# EAGLE board fc-comms-2 (EAGLE 9.0.1), part 1 of 2
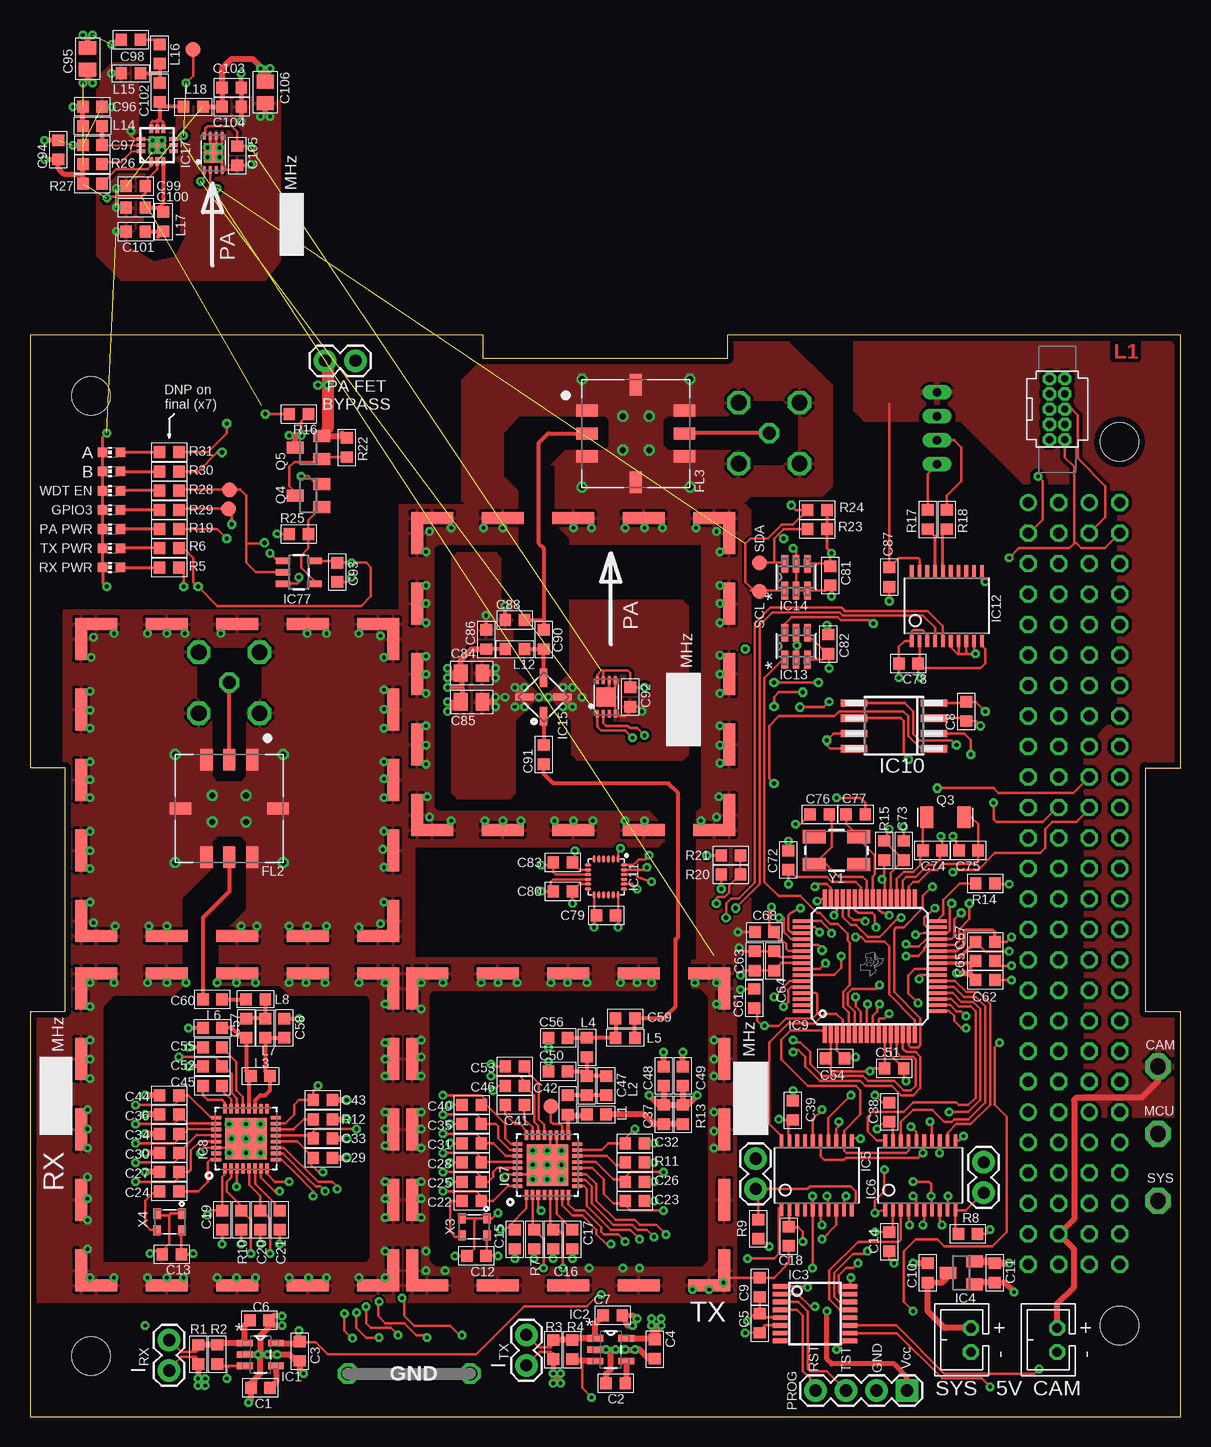
[diagram p2: board, top side]
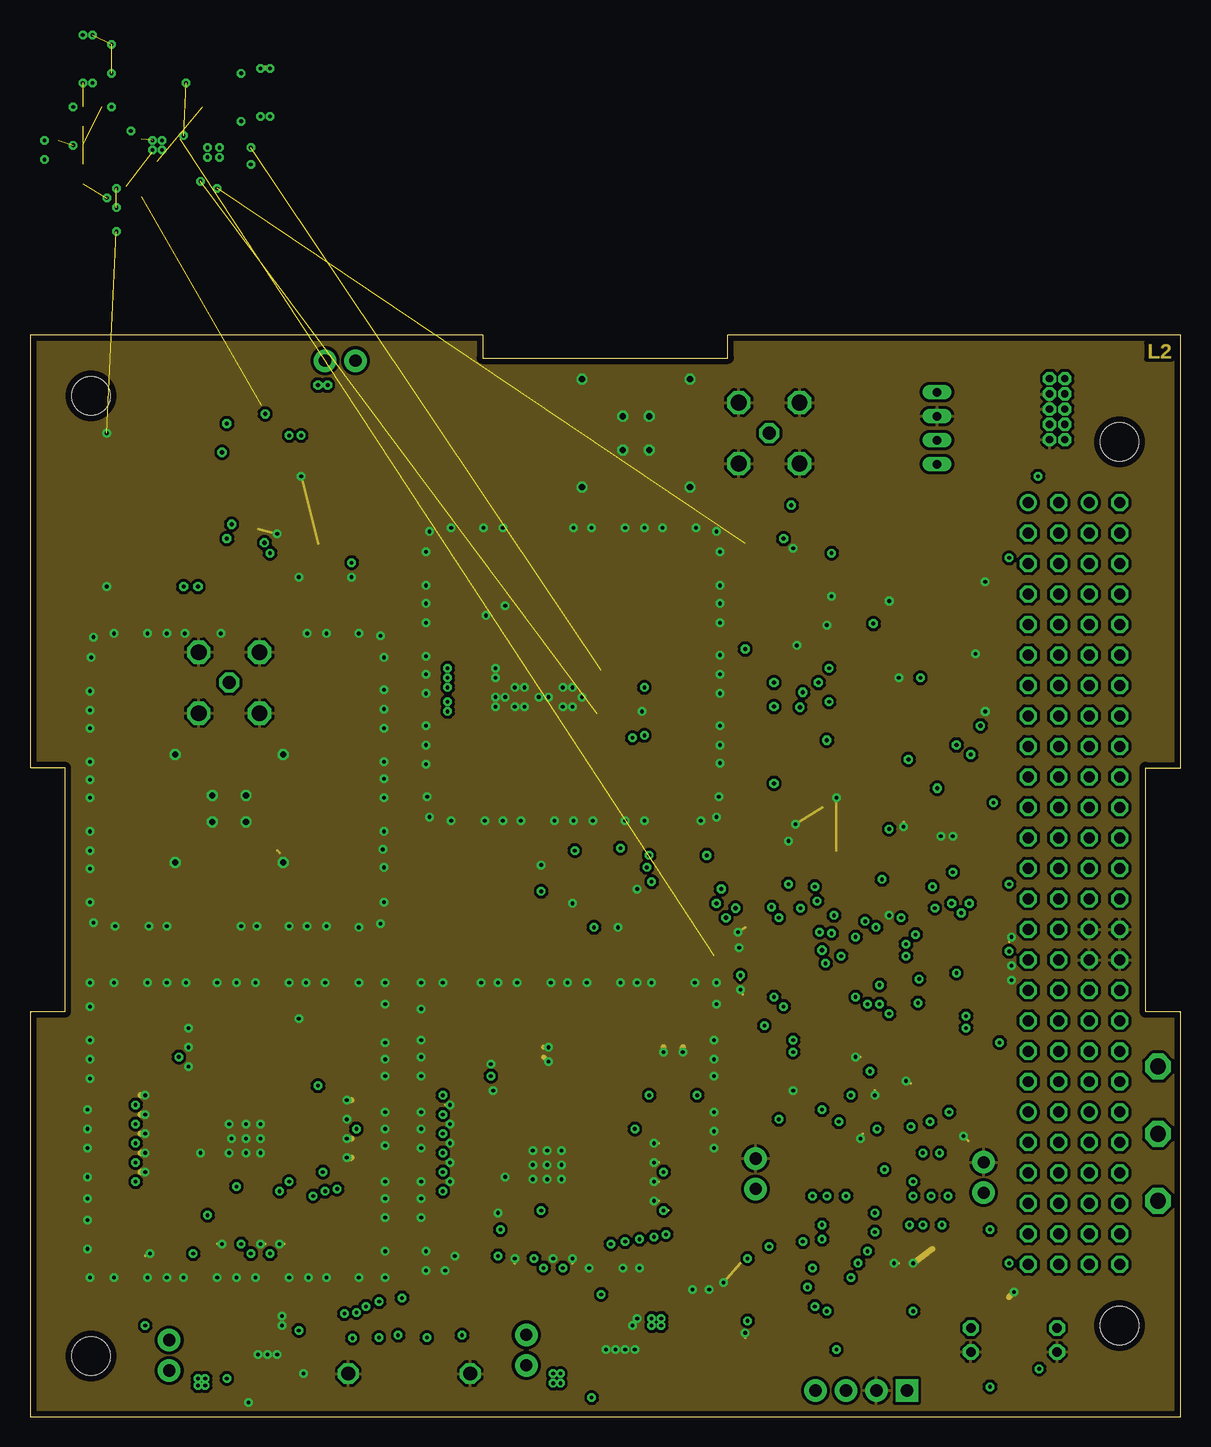
[diagram p3: board, inner layer Route2]
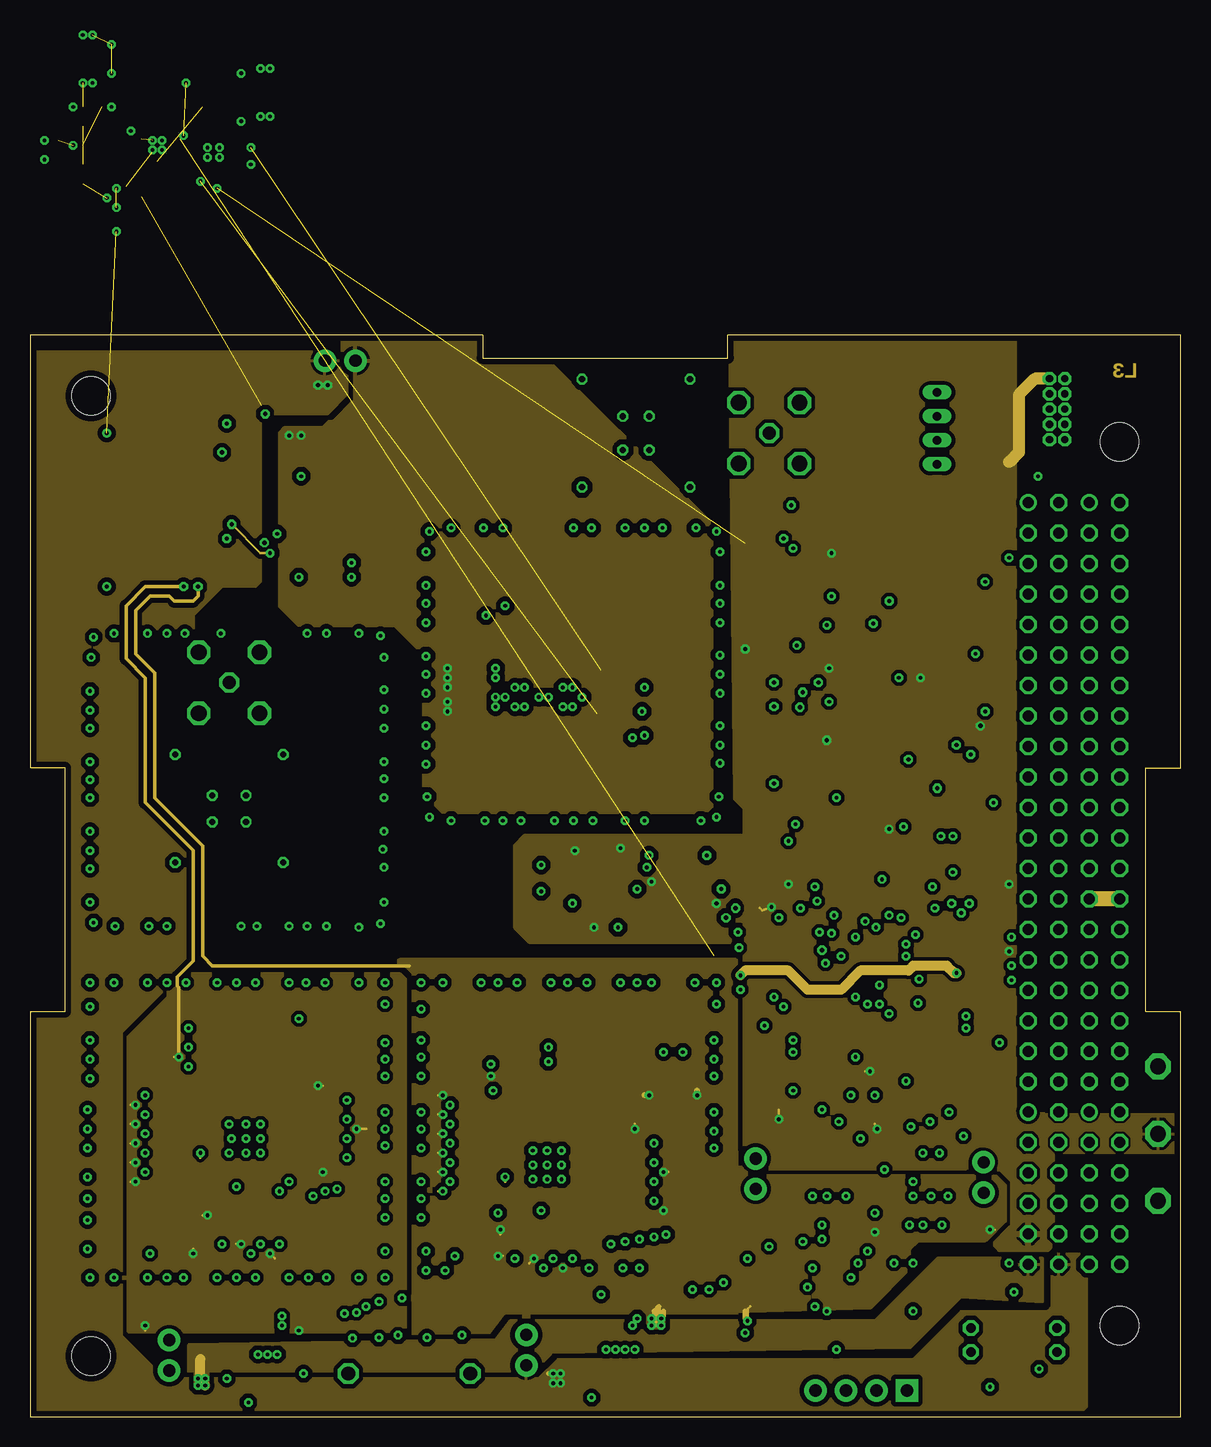
[diagram p4: board, inner layer Route15]
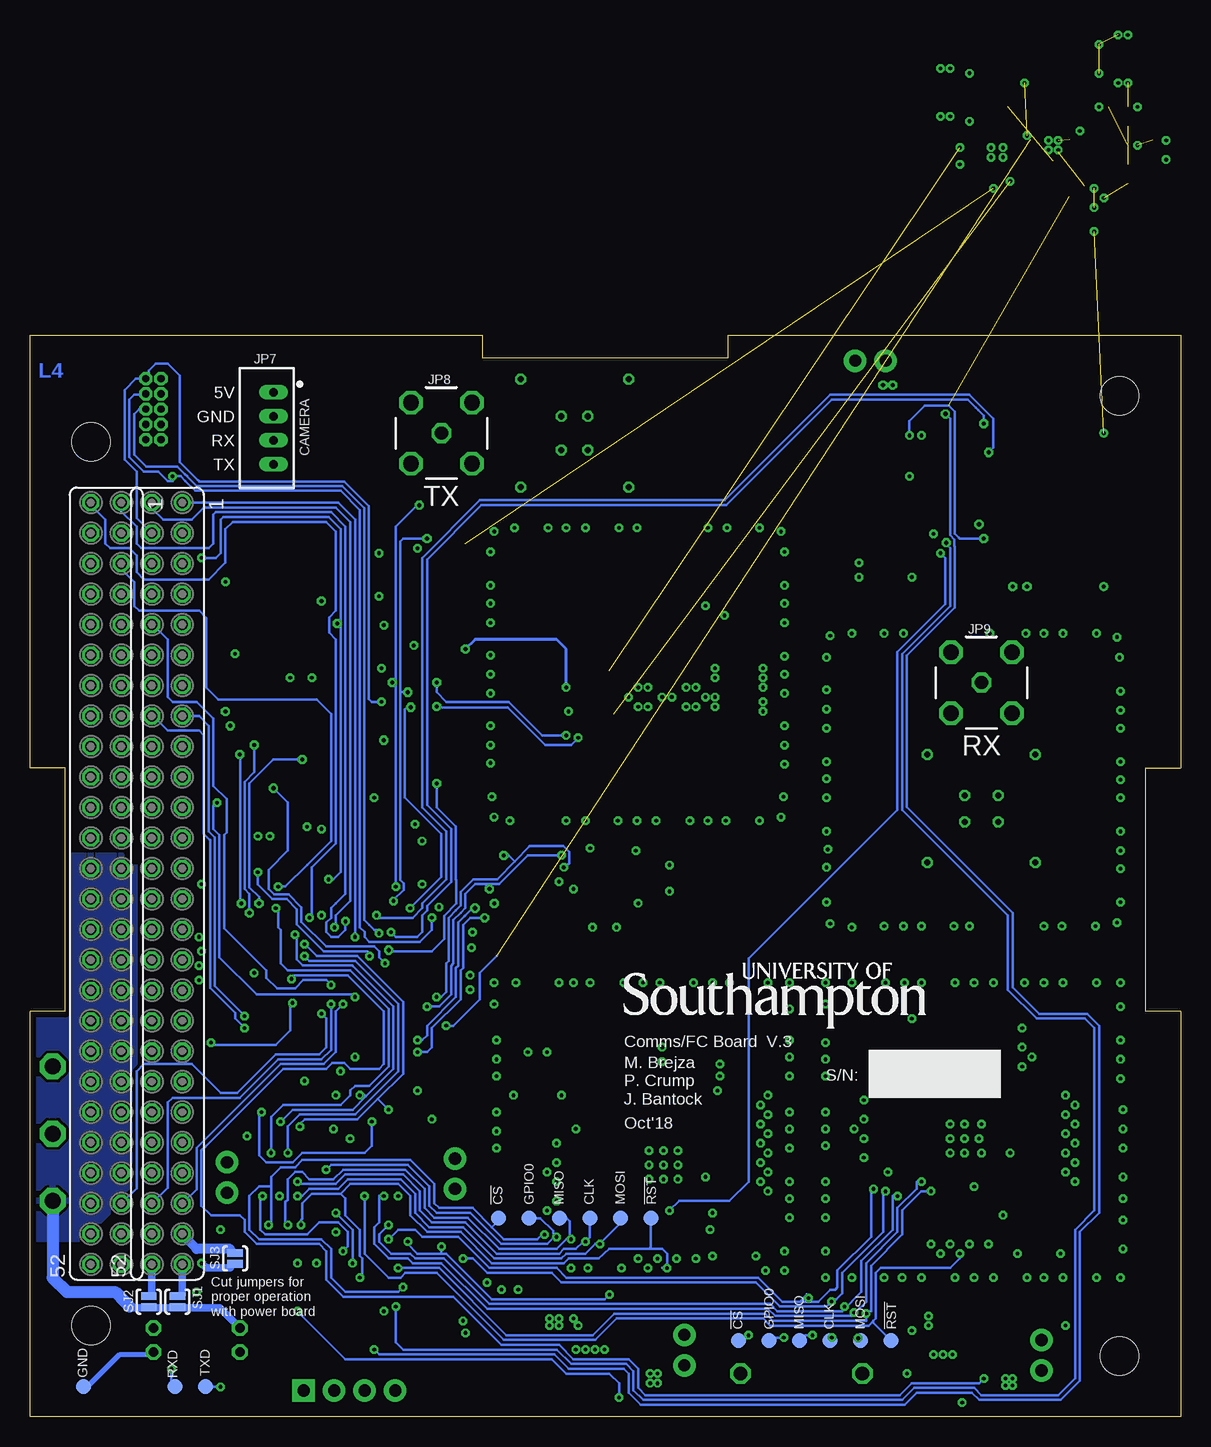
[diagram p5: board, bottom side, seen from below]

Size 95.89 x 90.17 mm. Coordinates in mm from the lower left corner, seen from the top.
Copper layers (1*2*15*16): Top 0.035mm / dielectric 0.15mm / Route2 0.035mm / dielectric 1.2mm / Route15 0.035mm / dielectric 0.15mm / Bottom 0.035mm
Design rules "default *": minimum track width 0.2mm, minimum drill 12mil, track to track 7mil, track to pad 7mil, pad to pad 7mil, via to via 8mil, smd to smd 5mil, copper to edge 20mil, drill to drill 8mil, minimum pad ring 10mil, minimum via ring 8mil, stop-mask expansion 4mil, vias tented up to drill 15mil, thermal gap 10mil

## Footprints (pad centres in the part's own frame; a part is rotated, then mirrored left to right if it is on the bottom)
C0603-N = smd 0.95 x 1: 1 -0.8,0; 2 0.8,0
C0805-N = smd 1.15 x 1.45: 1 -0.9,0; 2 0.9,0
PL-176 = smd 1.016 x 1.778: 1 -1.905,-4.064; 2 0,-4.064; 3 1.905,-4.064; 5 1.905,4.064; 6 0,4.064; 7 -1.905,4.064 | smd 1.778 x 1.016: 4 4.064,0; 8 -4.064,0
GND-LOOP-0.4 = drill 1.15 octagon: P$3 -5.08,0; P$4 5.08,0
SOT95P280X110-5N = smd 1.321 x 0.559: 1 -1.295,0.94; 2 -1.295,0; 3 -1.295,-0.94; 4 1.295,-0.94; 5 1.295,0.94
SSOP16 = smd 0.4 x 1.2: 1 -2.275,-2.925; 2 -1.625,-2.925; 3 -0.975,-2.925; 4 -0.325,-2.925; 5 0.325,-2.925; 6 0.975,-2.925; 7 1.625,-2.925; 8 2.275,-2.925; 9 2.275,2.925; 10 1.625,2.925; 11 0.975,2.925; 12 0.325,2.925; 13 -0.325,2.925; 14 -0.975,2.925; 15 -1.625,2.925; 16 -2.275,2.925
SOT23 = smd 1 x 1.4: 1 -0.95,-1.1; 2 0.95,-1.1; 3 0,1.1
TSSOP20 = smd 0.305 x 0.991: 1 -2.925,-2.918; 2 -2.275,-2.918; 3 -1.625,-2.918; 4 -0.975,-2.918; 5 -0.325,-2.918; 6 0.325,-2.918; 7 0.975,-2.918; 8 1.625,-2.918; 9 2.275,-2.918; 10 2.925,-2.918; 11 2.925,2.918; 12 2.275,2.918; 13 1.625,2.918; 14 0.975,2.918; 15 0.325,2.918; 16 -0.325,2.918; 17 -0.975,2.918; 18 -1.625,2.918; 19 -2.275,2.918; 20 -2.925,2.918
QFN32_5X5 = smd 0.813 x 0.305: 1 -2.489,1.753; 2 -2.489,1.245; 3 -2.489,0.762; 4 -2.489,0.254; 5 -2.489,-0.254; 6 -2.489,-0.762; 7 -2.489,-1.245; 8 -2.489,-1.753; 17 2.489,-1.753; 18 2.489,-1.245; 19 2.489,-0.762; 20 2.489,-0.254; 21 2.489,0.254; 22 2.489,0.762; 23 2.489,1.245; 24 2.489,1.753 | smd 0.305 x 0.813: 9 -1.753,-2.489; 10 -1.245,-2.489; 11 -0.762,-2.489; 12 -0.254,-2.489; 13 0.254,-2.489; 14 0.762,-2.489; 15 1.245,-2.489; 16 1.753,-2.489; 25 1.753,2.489; 26 1.245,2.489; 27 0.762,2.489; 28 0.254,2.489; 29 -0.254,2.489; 30 -0.762,2.489; 31 -1.245,2.489; 32 -1.753,2.489 | smd 3.45 x 3.45: 33 0,0
PM_S-PQFP-G64 = smd 1.6 x 0.3: 1 -5.6,3.75; 2 -5.6,3.25; 3 -5.6,2.75; 4 -5.6,2.25; 5 -5.6,1.75; 6 -5.6,1.25; 7 -5.6,0.75; 8 -5.6,0.25; 9 -5.6,-0.25; 10 -5.6,-0.75; 11 -5.6,-1.25; 12 -5.6,-1.75; 13 -5.6,-2.25; 14 -5.6,-2.75; 15 -5.6,-3.25; 16 -5.6,-3.75; 33 5.6,-3.75; 34 5.6,-3.25; 35 5.6,-2.75; 36 5.6,-2.25; 37 5.6,-1.75; 38 5.6,-1.25; 39 5.6,-0.75; 40 5.6,-0.25; 41 5.6,0.25; 42 5.6,0.75; 43 5.6,1.25; 44 5.6,1.75; 45 5.6,2.25; 46 5.6,2.75; 47 5.6,3.25; 48 5.6,3.75 | smd 0.3 x 1.6: 17 -3.75,-5.6; 18 -3.25,-5.6; 19 -2.75,-5.6; 20 -2.25,-5.6; 21 -1.75,-5.6; 22 -1.25,-5.6; 23 -0.75,-5.6; 24 -0.25,-5.6; 25 0.25,-5.6; 26 0.75,-5.6; 27 1.25,-5.6; 28 1.75,-5.6; 29 2.25,-5.6; 30 2.75,-5.6; 31 3.25,-5.6; 32 3.75,-5.6; 49 3.75,5.6; 50 3.25,5.6; 51 2.75,5.6; 52 2.25,5.6; 53 1.75,5.6; 54 1.25,5.6; 55 0.75,5.6; 56 0.25,5.6; 57 -0.25,5.6; 58 -0.75,5.6; 59 -1.25,5.6; 60 -1.75,5.6; 61 -2.25,5.6; 62 -2.75,5.6; 63 -3.25,5.6; 64 -3.75,5.6
SO-08M = smd 0.6 x 2.2: 1 -1.905,-3.33; 2 -0.635,-3.33; 3 0.635,-3.33; 4 1.905,-3.33; 5 1.905,3.33; 6 0.635,3.33; 7 -0.635,3.33; 8 -1.905,3.33
QFN-24/3MM = smd 0.6 x 0.23: 1 -1.5,1; 2 -1.5,0.6; 3 -1.5,0.2; 4 -1.5,-0.2; 5 -1.5,-0.6; 6 -1.5,-1; 13 1.5,-1; 14 1.5,-0.6; 15 1.5,-0.2; 16 1.5,0.2; 17 1.5,0.6; 18 1.5,1 | smd 0.23 x 0.6: 7 -1,-1.5; 8 -0.6,-1.5; 9 -0.2,-1.5; 10 0.2,-1.5; 11 0.6,-1.5; 12 1,-1.5; 19 1,1.5; 20 0.6,1.5; 21 0.2,1.5; 22 -0.2,1.5; 23 -0.6,1.5; 24 -1,1.5
DBV6 = smd 1.473 x 0.559: 1 -1.118,0.95; 2 -1.118,0; 3 -1.118,-0.95; 4 1.118,-0.95; 5 1.118,0; 6 1.118,0.95
PA = smd 1.55 x 0.61: GND1 -1.59,0; GND2 1.59,0 | smd 0.61 x 1.55: RF_IN 0,-1.59; RF_OUT 0,1.59
HWSON8 = smd 0.25 x 0.625: 1 -0.75,-1.41; 2 -0.25,-1.41; 3 0.25,-1.41; 4 0.75,-1.41; 5 0.75,1.41; 6 0.25,1.41; 7 -0.25,1.41; 8 -0.75,1.41 | smd 1.6 x 1.6: EP 0,0
QFN3X3-6 = smd 0.7 x 0.3: 1 -1.35,0.5; 2 -1.35,0; 3 -1.35,-0.5; 7 1.35,-0.5; 8 1.35,0; 9 1.35,0.5 | smd 0.3 x 0.7: 4 -0.5,-1.35; 5 0,-1.35; 6 0.5,-1.35; 10 0.5,1.35; 11 0,1.35; 12 -0.5,1.35 | smd 1.45 x 1.45: EXP 0,0
SOT23-5 = smd 0.55 x 1.2: 1 -0.95,-1.3; 2 0,-1.3; 3 0.95,-1.3; 4 0.95,1.3; 5 -0.95,1.3
JST-2-TH = drill 0.8 octagon: 1 1,0; 2 -1,0
SWD_PTH_SHROUD = drill 0.6 octagon: 1 -2.54,-0.635; 2 -2.54,0.635; 3 -1.27,-0.635; 4 -1.27,0.635; 5 0,-0.635; 6 0,0.635; 7 1.27,-0.635; 8 1.27,0.635; 9 2.54,-0.635; 10 2.54,0.635
1X04 = drill 1.016 pad 1.88 square: 1 0,0 | drill 1.016 pad 1.88: 2 2.54,0; 3 5.08,0; 4 7.62,0
1X02 = drill 1.016 pad 1.88: 1 0,0; 2 2.54,0
B4B-PH-K-S = drill 0.7 long: 1 -3,0; 2 -1,0; 3 1,0; 4 3,0
MCX-STRAIGHT = drill 1.1 octagon: P$1 0,0 | drill 1.3 octagon: P$2 2.54,2.54; P$3 -2.54,2.54; P$4 -2.54,-2.54; P$5 2.54,-2.54
L0603-N = smd 0.95 x 1: 1 -0.8,0; 2 0.8,0
CHIP-LED0603 = smd 0.8 x 0.8: A 0,-0.75; C 0,0.75
RESONATOR_EPSON_FC_145 = smd 1.1 x 1.8: P$1 -1.55,0; P$2 1.55,0
R0603-N = smd 0.95 x 1: 1 -0.8,0; 2 0.8,0
PAD-JUMPER-2-NO_YES_SILK = smd 0.635 x 1.27: 1 -0.45,0; 2 0.45,0
FE26-2 = drill 0.914: 1 -30.48,1.27; 41 20.32,1.27 | drill 0.914 octagon: 2 -30.48,-1.27; 3 -27.94,1.27; 4 -27.94,-1.27; 5 -25.4,1.27; 6 -25.4,-1.27; 7 -22.86,1.27; 8 -22.86,-1.27; 9 -20.32,1.27; 10 -20.32,-1.27; 11 -17.78,1.27; 12 -17.78,-1.27; 13 -15.24,1.27; 14 -15.24,-1.27; 15 -12.7,1.27; 16 -12.7,-1.27; 17 -10.16,1.27; 18 -10.16,-1.27; 19 -7.62,1.27; 20 -7.62,-1.27; 21 -5.08,1.27; 22 -5.08,-1.27; 23 -2.54,1.27; 24 -2.54,-1.27; 25 0,1.27; 26 0,-1.27; 27 2.54,1.27; 28 2.54,-1.27; 29 5.08,1.27; 30 5.08,-1.27; 31 7.62,1.27; 32 7.62,-1.27; 33 10.16,1.27; 34 10.16,-1.27; 35 12.7,1.27; 36 12.7,-1.27; 37 15.24,1.27; 38 15.24,-1.27; 39 17.78,1.27; 40 17.78,-1.27; 42 20.32,-1.27; 43 22.86,1.27; 44 22.86,-1.27; 45 25.4,1.27; 46 25.4,-1.27; 47 27.94,1.27; 48 27.94,-1.27; 49 30.48,1.27; 50 30.48,-1.27; 51 33.02,1.27; 52 33.02,-1.27
P1-13 = drill 1.321 pad 2.159 octagon: TP 0,0
B1,27 = smd 1.27 x 1.27: TP 0,0
OUTLINE = hole 3.2: 5.08,5.08; 5.08,85.09; 90.805,7.62; 90.805,81.28
SHIELD-26X26 = smd 3.5 x 1: G1 1.75,0.5; G7 25.25,26.5; G8 1.75,26.5; G9 13.5,26.5; G10 7.625,26.5; G11 19.375,26.5; G17 25.25,0.5; G19 13.5,0.5; G20 7.625,0.5; G21 19.375,0.5 | smd 1 x 3.5: G2 0.5,1.75; G3 0.5,25.25; G4 0.5,13.5; G5 0.5,19.375; G6 0.5,7.625; G12 26.5,1.75; G13 26.5,25.25; G14 26.5,13.5; G15 26.5,19.375; G16 26.5,7.625
260-SERIES = smd 0.63 x 0.84: 1 -1.04,-0.7; 3 1.04,-0.7; 4 1.04,0.7; 6 -1.04,0.7
CRYSTAL-SMD-5X3.2-4PAD = smd 1.9 x 1.1: 1 -1.85,-1.15; 2 1.85,-1.15; 3 1.85,1.15; 4 -1.85,1.15

## Placement (x,y rotation side)
C1  10n  [C0603-N]  19.2,2.4 180 top
C2  10n  [C0603-N]  48.8,2.8 180 top
C3  2u2  [C0603-N]  22.46,5.47 270 top
C4  2u2  [C0603-N]  52.06,5.64 270 top
C5  1u  [C0603-N]  60.8,7.8 270 top
C6  2u2  [C0603-N]  19.12,8.06 0 top
C7  2u2  [C0603-N]  48.55,8.46 0 top
C8  0.1u  [C0603-N]  78,58.8 90 top
C9  100n  [C0603-N]  60.8,10.8 90 top
C10  4.7u  [C0603-N]  74.8,12 90 top
C11  4.7u  [C0603-N]  80.4,12 270 top
C12  100n  [C0603-N]  37.2,13.4 180 top
C13  100n  [C0603-N]  11.82,13.56 180 top
C14  100n  [C0603-N]  71.6,14.6 270 top
C15  47n  [C0603-N]  40.4,14.8 90 top
C16  47n  [C0603-N]  43.6,14.8 90 top
C17  220n  [C0603-N]  45.2,14.8 270 top
C18  100n  [C0603-N]  63.24,15.06 270 top
C19  47n  [C0603-N]  16,16.4 90 top
C20  47n  [C0603-N]  19.2,16.4 90 top
C21  220n  [C0603-N]  20.8,16.4 270 top
C22  10n  [C0603-N]  36.8,18 0 top
C23  47n  [C0603-N]  50.4,18 180 top
C24  10n  [C0603-N]  11.6,18.8 0 top
C25  47n  [C0603-N]  36.8,19.6 0 top
C26  47n  [C0603-N]  50.4,19.6 180 top
C27  47n  [C0603-N]  11.6,20.4 0 top
C28  47n  [C0603-N]  36.8,21.2 0 top
C29  47n  [C0603-N]  24.4,21.6 180 top
C30  47n  [C0603-N]  11.6,22 0 top
C31  47n  [C0603-N]  36.8,22.8 0 top
C32  47n  [C0603-N]  50.4,22.8 180 top
C33  47n  [C0603-N]  24.4,23.2 180 top
C34  47n  [C0603-N]  11.6,23.6 0 top
C35  47n  [C0603-N]  36.8,24.4 0 top
C36  47n  [C0603-N]  11.6,25.2 0 top
C37  100p  [C0603-N]  52.8,25.2 270 top
C38  100n  [C0603-N]  71.6,25.4 90 top
C39  100n  [C0603-N]  63.56,25.55 90 top
C40  47n  [C0603-N]  36.8,26 0 top
C41  1.8n  [C0603-N]  40.4,26 180 top
C42  82p  [C0603-N]  44.8,26 90 top
C43  47n  [C0603-N]  24.4,26.4 180 top
C44  47n  [C0603-N]  11.6,26.8 0 top
C45  1.8n  [C0603-N]  15.2,27.6 180 top
C46  47n  [C0603-N]  40.4,27.6 0 top
C47  12p  [C0603-N]  46.4,27.6 90 top
C48  100p  [C0603-N]  52.8,28.4 90 top
C49  10n  [C0603-N]  54.4,28.4 90 top
C50  12p  [C0603-N]  44,28.8 0 top
C51  0.01u  [C0603-N]  72.01,29.06 0 top
C52  47n  [C0603-N]  15.2,29.2 0 top
C53  10n  [C0603-N]  40.4,29.2 180 top
C54  1.0u  [C0603-N]  67.09,29.88 0 top
C55  10n  [C0603-N]  15.2,30.8 180 top
C56  15p  [C0603-N]  44,31.6 0 top
C57  5.1p  [C0603-N]  18,32.4 90 top
C58  5.1p  [C0603-N]  21.2,32.4 90 top
C59  1.2p  [C0603-N]  49.6,33.2 0 top
C60  [C0603-N]  15.2,34.8 180 top
C61  100p  [C0603-N]  60.34,34.87 90 top
C62  2.2u  [C0603-N]  79.6,36.4 0 top
C63  0.1u  [C0603-N]  60.4,38 90 top
C64  0.1u  [C0603-N]  62,38 90 top
C65  1.0u  [C0603-N]  79.6,38 0 top
C67  0.01u  [C0603-N]  79.6,39.6 0 top
C68  0.01u  [C0603-N]  61.2,40.4 180 top
C72  0.1u  [C0603-N]  63.2,46.4 90 top
C73  0.1u  [C0603-N]  72.8,47.2 90 top
C74  24p  [C0603-N]  75.2,47.2 0 top
C75  24p  [C0603-N]  78.2,47.2 180 top
C76  10p  [C0603-N]  65.8,50.2 180 top
C77  10p  [C0603-N]  68.8,50.2 0 top
C78  0.1u  [C0603-N]  73.2,62.8 180 top
C79  0.1u  [C0603-N]  48,41.8 0 top
C80  0.1u  [C0603-N]  44.4,43.8 0 top
C81  0.1u  [C0603-N]  66.68,70.11 270 top
C82  0.1u  [C0603-N]  66.52,64.41 90 top
C83  0.01u  [C0603-N]  44.4,46.2 180 top
C84  [C0805-N]  36.8,62 0 top
C85  [C0805-N]  36.8,59.6 0 top
C86  ??  [C0603-N]  38,64.8 270 top
C87  0.1u  [C0603-N]  71.6,70 270 top
C88  dnp  [C0603-N]  40.4,66.4 0 top
C90  ??  [C0603-N]  42.8,64.8 90 top
C91  1n  [C0603-N]  42.8,55.2 90 top
C92  100n  [C0603-N]  50,60 270 top
C93  100n  [C0603-N]  25.6,70.4 270 top
C94  1u  [C0603-N]  2.34,105.61 90 top  (outside the outline)
C95  [C0805-N]  4.8,113.2 90 top  (outside the outline)
C96  1u  [C0603-N]  5.2,109.2 0 top  (outside the outline)
C97  3.3p  [C0603-N]  5.2,106 180 top  (outside the outline)
C98  33p  [C0603-N]  8.4,114.8 180 top  (outside the outline)
C99  100p  [C0603-N]  8.8,102.6 180 top  (outside the outline)
C100  27p  [C0603-N]  8.8,100.8 180 top  (outside the outline)
C101  15p  [C0603-N]  8.8,98.8 180 top  (outside the outline)
C102  220p  [C0603-N]  10.8,110.4 270 top  (outside the outline)
C103  4.7u  [C0603-N]  16.8,110.8 0 top  (outside the outline)
C104  1n  [C0603-N]  16.8,109.2 0 top  (outside the outline)
C105  100n  [C0603-N]  17.26,105.12 270 top  (outside the outline)
C106  [C0805-N]  19.6,110.4 270 top  (outside the outline)
FL2  SAW_FILTER_CS  [PL-176]  16.61,50.71 180 top
FL3  LPF_CS  [PL-176]  50.49,81.97 270 top
G1  GND-LOOPL  [GND-LOOP-0.4]  31.6,3.6 0 top
IC1  TPS79930QDDCRQ1  [SOT95P280X110-5N]  19.2,5.2 0 top
IC2  TPS79930QDDCRQ1  [SOT95P280X110-5N]  48.4,5.6 0 top
IC3  MSP430FR2311PW  [SSOP16]  65.41,8.6 270 top
IC4  MCP1700TT  [SOT23]  77.6,12 90 top
IC5  TXB0108PW  [TSSOP20]  65.56,20.12 0 top
IC6  TXB0108PW  [TSSOP20]  74.19,20.12 0 top
IC7  CC1125RHBT  [QFN32_5X5]  43.12,20.99 90 top
IC8  CC1125RHBT  [QFN32_5X5]  18,23.2 90 top
IC9  TM4C123[7,G]XXPM  [PM_S-PQFP-G64]  69.98,37.57 90 top
IC10  FM25V10  [SO-08M]  72,57.6 90 top
IC11  MPU-9250  [QFN-24/3MM]  48,45 270 top
IC12  TXB0108PW  [TSSOP20]  76.4,67.6 0 top
IC13  TPS3813K33-EP_DBV_6  [DBV6]  63.84,64.25 90 top
IC14  TMP100-EP_DBV_6  [DBV6]  63.84,70 90 top
IC15  LHA1+  [PA]  42.8,60 0 top
IC16  PCT2075TP  [HWSON8]  48,60 0 top
IC17  MMZ09332BT1  [QFN3X3-6]  10.6,106 90 top  (outside the outline)
IC18  PCT2075TP  [HWSON8]  15.27,105.36 0 top  (outside the outline)
IC77  74LVC1G08  [SOT23-5]  22.4,70.4 270 top
J1  [JST-2-TH]  78.4,6.4 90 top
J2  [JST-2-TH]  85.6,6.4 90 top
J3  SWD_SHROUD  [SWD_PTH_SHROUD]  85.6,84 270 top
JP1  [1X04]  73.08,2.19 180 top
JP2  M02PTH  [1X02]  41.36,4.29 90 top
JP3  M02PTH  [1X02]  11.6,6.4 270 top
JP5  M02PTH  [1X02]  79.47,18.68 90 top
JP6  M02PTH  [1X02]  60.47,18.99 90 top
JP7  B4B-PH-K-S  [B4B-PH-K-S]  75.6,82.4 270 bottom
JP8  MCX  [MCX-STRAIGHT]  61.6,82 0 bottom
JP9  MCX  [MCX-STRAIGHT]  16.6,61.2 0 bottom
JP10  M02PTH  [1X02]  24.58,88.04 0 top
L1  220n  [L0603-N]  47.2,25.2 0 top
L2  18n  [L0603-N]  48,27.6 90 top
L3  56n  [L0603-N]  19.2,28.4 0 top
L4  100n  [L0603-N]  46.4,30.8 90 top
L5  68n  [L0603-N]  49.6,31.6 0 top
L6  27n  [L0603-N]  15.2,32.4 0 top
L7  27u  [L0603-N]  19.6,32.4 90 top
L8  15n  [L0603-N]  18.8,34.8 180 top
L12  220n  [L0603-N]  40.4,64 180 top
L14  33n  [L0603-N]  5.2,107.6 180 top  (outside the outline)
L15  33n  [L0603-N]  8.4,112 0 top  (outside the outline)
L16  33n  [L0603-N]  10.8,113.6 90 top  (outside the outline)
L17  22n  [L0603-N]  11.12,99.63 90 top  (outside the outline)
L18  33n  [L0603-N]  13.6,109.2 0 top  (outside the outline)
LED1  [CHIP-LED0603]  6.8,72.4 90 top
LED2  [CHIP-LED0603]  6.8,70.8 90 top
LED4  [CHIP-LED0603]  6.8,74 90 top
LED5  [CHIP-LED0603]  6.8,77.2 90 top
LED6  [CHIP-LED0603]  6.8,75.6 90 top
LED7  [CHIP-LED0603]  6.8,78.8 90 top
LED8  [CHIP-LED0603]  6.8,80.4 90 top
Q3  32.768kHz  [RESONATOR_EPSON_FC_145]  76.28,49.98 0 top
Q4  BSS123  [SOT23]  23.2,76.8 90 top
Q5  BSS84  [SOT23]  23.2,80.8 90 top
R1  0.2  [R0603-N]  14,5.2 90 top
R2  10k  [R0603-N]  15.6,5.2 90 top
R3  0.2  [R0603-N]  43.6,5.6 90 top
R4  10k  [R0603-N]  45.2,5.6 90 top
R5  [R0603-N]  11.6,70.8 180 top
R6  [R0603-N]  11.6,72.4 180 top
R7  100k  [R0603-N]  42,14.8 270 top
R8  10k  [R0603-N]  78.16,15.27 0 top
R9  10k  [R0603-N]  60.67,15.65 270 top
R10  100k  [R0603-N]  17.6,16.4 270 top
R11  56k 0.5%  [R0603-N]  50.4,21.2 0 top
R12  56k 0.5%  [R0603-N]  24.4,24.8 0 top
R13  22  [R0603-N]  54.4,25.2 90 top
R14  1M  [R0603-N]  79.61,44.46 0 top
R15  10k  [R0603-N]  71.2,47.2 90 top
R16  10k  [R0603-N]  22.4,83.6 180 top
R17  1k  [R0603-N]  74.8,74.8 270 top
R18  1k  [R0603-N]  76.4,74.8 270 top
R19  [R0603-N]  11.6,74 180 top
R20  4k7  [R0603-N]  58.4,45.2 0 top
R21  4k7  [R0603-N]  58.4,46.8 0 top
R22  100k  [R0603-N]  26.4,80.8 90 top
R23  4k7  [R0603-N]  65.6,74 0 top
R24  4k7  [R0603-N]  65.6,75.6 0 top
R25  10k  [R0603-N]  22.4,73.6 0 top
R26  1.8k  [R0603-N]  5.2,104.4 0 top  (outside the outline)
R27  2.2k  [R0603-N]  5.2,102.8 0 top  (outside the outline)
R28  [R0603-N]  11.6,77.2 0 top
R29  [R0603-N]  11.6,75.6 0 top
R30  [R0603-N]  11.6,78.8 0 top
R31  [R0603-N]  11.6,80.4 0 top
SJ1  JUMPER-PAD-2-NOYES_SILK  [PAD-JUMPER-2-NO_YES_SILK]  83.6,9.6 90 bottom
SJ2  JUMPER-PAD-2-NOYES_SILK  [PAD-JUMPER-2-NO_YES_SILK]  86,9.6 90 bottom
SJ3  JUMPER-PAD-2-NOYES_SILK  [PAD-JUMPER-2-NO_YES_SILK]  78.8,13.2 90 bottom
SV2  H1  [FE26-2]  84.45,45.72 270 bottom
SV3  H2  [FE26-2]  89.53,45.72 270 bottom
TP1  PTR1PAD1-13  [P1-13]  94,18 0 top
TP2  PTR1PAD1-13  [P1-13]  94,23.6 0 top
TP3  PTR1B1,27  [B1,27]  43.41,25.89 0 top
TP4  PTR1PAD1-13  [P1-13]  94,29.2 0 top
TP6  PTR1B1,27  [B1,27]  44.14,16.56 0 bottom
TP7  PTR1B1,27  [B1,27]  56.84,16.56 0 bottom
TP8  PTR1B1,27  [B1,27]  49.22,16.56 0 bottom
TP9  PTR1B1,27  [B1,27]  60.8,71.2 0 top
TP10  PTR1B1,27  [B1,27]  60.8,68.8 0 top
TP11  PTR1B1,27  [B1,27]  46.68,16.56 0 bottom
TP12  PTR1B1,27  [B1,27]  51.76,16.56 0 bottom
TP13  PTR1B1,27  [B1,27]  54.3,16.56 0 bottom
TP14  PTR1B1,27  [B1,27]  16.61,77.29 0 top
TP15  PTR1B1,27  [B1,27]  16.53,75.69 0 top
TP16  PTR1B1,27  [B1,27]  13.6,114 270 top  (outside the outline)
TP17  PTR1B1,27  [B1,27]  24.13,6.35 270 bottom
TP18  PTR1B1,27  [B1,27]  26.67,6.35 270 bottom
TP19  PTR1B1,27  [B1,27]  29.21,6.35 270 bottom
TP20  PTR1B1,27  [B1,27]  31.75,6.35 270 bottom
TP21  PTR1B1,27  [B1,27]  34.29,6.35 270 bottom
TP22  PTR1B1,27  [B1,27]  36.83,6.35 270 bottom
TP23  PTR1B1,27  [B1,27]  81.28,2.54 0 bottom
TP24  PTR1B1,27  [B1,27]  83.82,2.54 0 bottom
TP25  PTR1B1,27  [B1,27]  91.44,2.54 0 bottom
U$1  [OUTLINE]  0,0 0 top
U$2  [UOS_LOGO_SML]  46.4,32.4 0 bottom
X1  SHIELD-26X26  [SHIELD-26X26]  3.75,10.47 0 top
X2  SHIELD-26X26  [SHIELD-26X26]  31.36,10.47 0 top
X3  LFTCXO070  [260-SERIES]  37.03,15.84 180 top
X4  LFTCXO070  [260-SERIES]  11.64,16.24 180 top
X5  SHIELD-26X26  [SHIELD-26X26]  3.75,39.6 0 top
X6  SHIELD-26X26  [SHIELD-26X26]  31.76,48.4 0 top
Y1  8MHz  [CRYSTAL-SMD-5X3.2-4PAD]  67.2,47.2 180 top